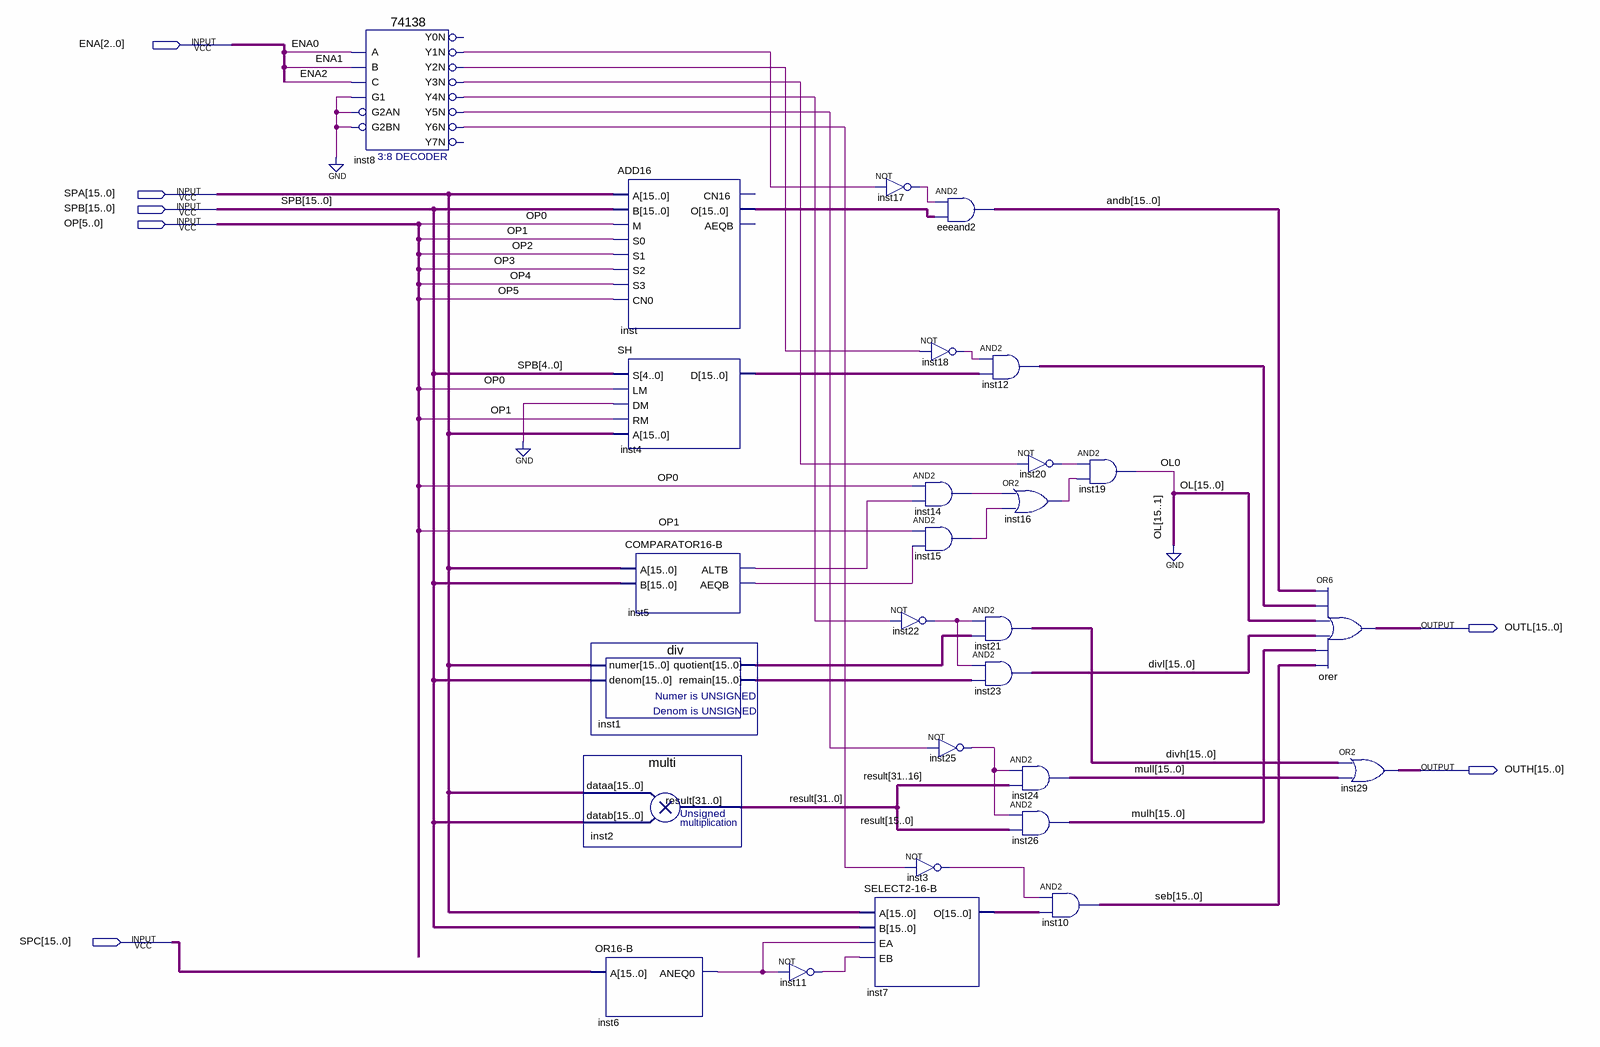
[diagram p0: schematic sheet]
// Quartus schematic ALU16.bdf as structural Verilog: 28 symbols, 7 pins
module ALU16 (
  input  [2:0] ENA,
  input  [15:0] SPA,
  input  [15:0] SPB,
  input  [5:0] OP,
  input  [15:0] SPC,
  output [15:0] OUTL,
  output [15:0] OUTH
);

  wire inst3_out, inst5_aeqb, inst5_altb, inst6_aneq0, inst8_y1n, inst8_y2n, inst8_y3n, inst8_y4n, inst8_y5n,
       inst8_y6n, inst11_out, inst14_out, inst15_out, inst16_out, inst17_out, inst18_out, inst20_out,
       inst22_out, inst25_out;
  wire [0:0] OL;
  wire [15:0] andb, divh, divl, inst1_quotient, inst1_remain, inst4_d, inst7_o, inst12_out, inst_o, mulh,
       mull, seb;
  wire [31:0] result;

  \74138  inst8 (
    .A(ENA[0]), .B(ENA[1]), .G1(1'b0), .C(ENA[2]), .G2AN(1'b0), .G2BN(1'b0), .Y1N(inst8_y1n),
    .Y2N(inst8_y2n), .Y3N(inst8_y3n), .Y4N(inst8_y4n), .Y5N(inst8_y5n), .Y6N(inst8_y6n));  // open: Y0N, Y7N
  div inst1 (.numer(SPA), .denom(SPB), .quotient(inst1_quotient), .remain(inst1_remain));
  multi inst2 (.dataa(SPA), .datab(SPB), .result(result));
  \OR16-B  inst6 (.A(SPC), .ANEQ0(inst6_aneq0));
  ADD16 inst (
    .A(SPA), .B(SPB), .M(OP[0]), .S0(OP[1]), .S1(OP[2]), .S2(OP[3]), .S3(OP[4]), .CN0(OP[5]), .O(inst_o));  // open: CN16, AEQB
  SH inst4 (.S(SPB[4:0]), .LM(OP[0]), .DM(1'b0), .RM(OP[1]), .A(SPA), .D(inst4_d));
  \COMPARATOR16-B  inst5 (.A(SPA), .B(SPB), .ALTB(inst5_altb), .AEQB(inst5_aeqb));
  not inst11 (inst11_out, inst6_aneq0);
  not inst17 (inst17_out, inst8_y1n);
  not inst22 (inst22_out, inst8_y4n);
  \SELECT2-16-B  inst7 (.A(SPA), .B(SPB), .EA(inst6_aneq0), .EB(inst11_out), .O(inst7_o));
  assign andb = {16{inst17_out}} & inst_o;  // AND2 eeeand2, 16 bits wide
  not inst18 (inst18_out, inst8_y2n);
  and inst14 (inst14_out, OP[0], inst5_altb);
  and inst15 (inst15_out, OP[1], inst5_aeqb);
  not inst25 (inst25_out, inst8_y5n);
  not inst3 (inst3_out, inst8_y6n);
  assign inst12_out = {16{inst18_out}} & inst4_d;  // AND2 inst12, 16 bits wide
  or inst16 (inst16_out, inst14_out, inst15_out);
  assign divh = {16{inst22_out}} & inst1_quotient;  // AND2 inst21, 16 bits wide
  assign divl = {16{inst22_out}} & inst1_remain;  // AND2 inst23, 16 bits wide
  assign mull = {16{inst25_out}} & result[31:16];  // AND2 inst24, 16 bits wide
  assign mulh = {16{inst25_out}} & result[15:0];  // AND2 inst26, 16 bits wide
  not inst20 (inst20_out, inst8_y3n);
  assign seb = {16{inst3_out}} & inst7_o;  // AND2 inst10, 16 bits wide
  and inst19 (OL[0], inst20_out, inst16_out);
  assign OUTL = andb | inst12_out | {{15{1'b0}}, OL[0]} | divl | mulh | seb;  // OR6 orer, 16 bits wide
  assign OUTH = divh | mull;  // OR2 inst29, 16 bits wide
endmodule
